# Altium project PCB_Project.PrjPcb
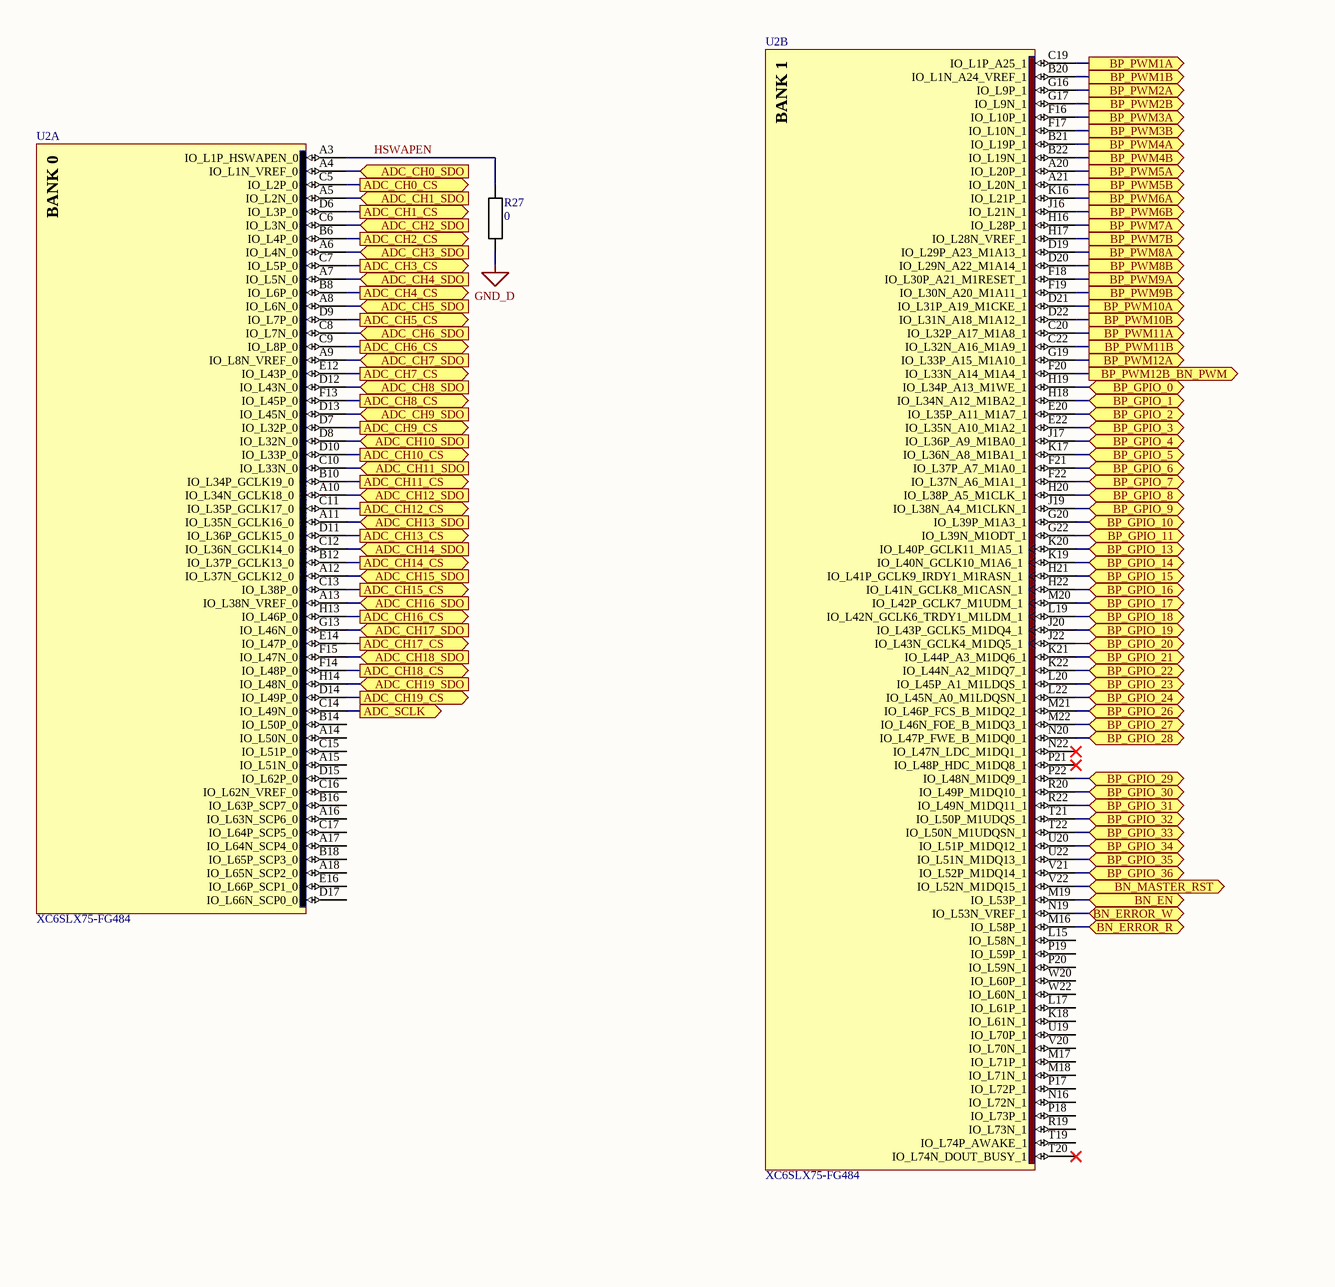
[diagram p0: FPGA_0.SchDoc, left]
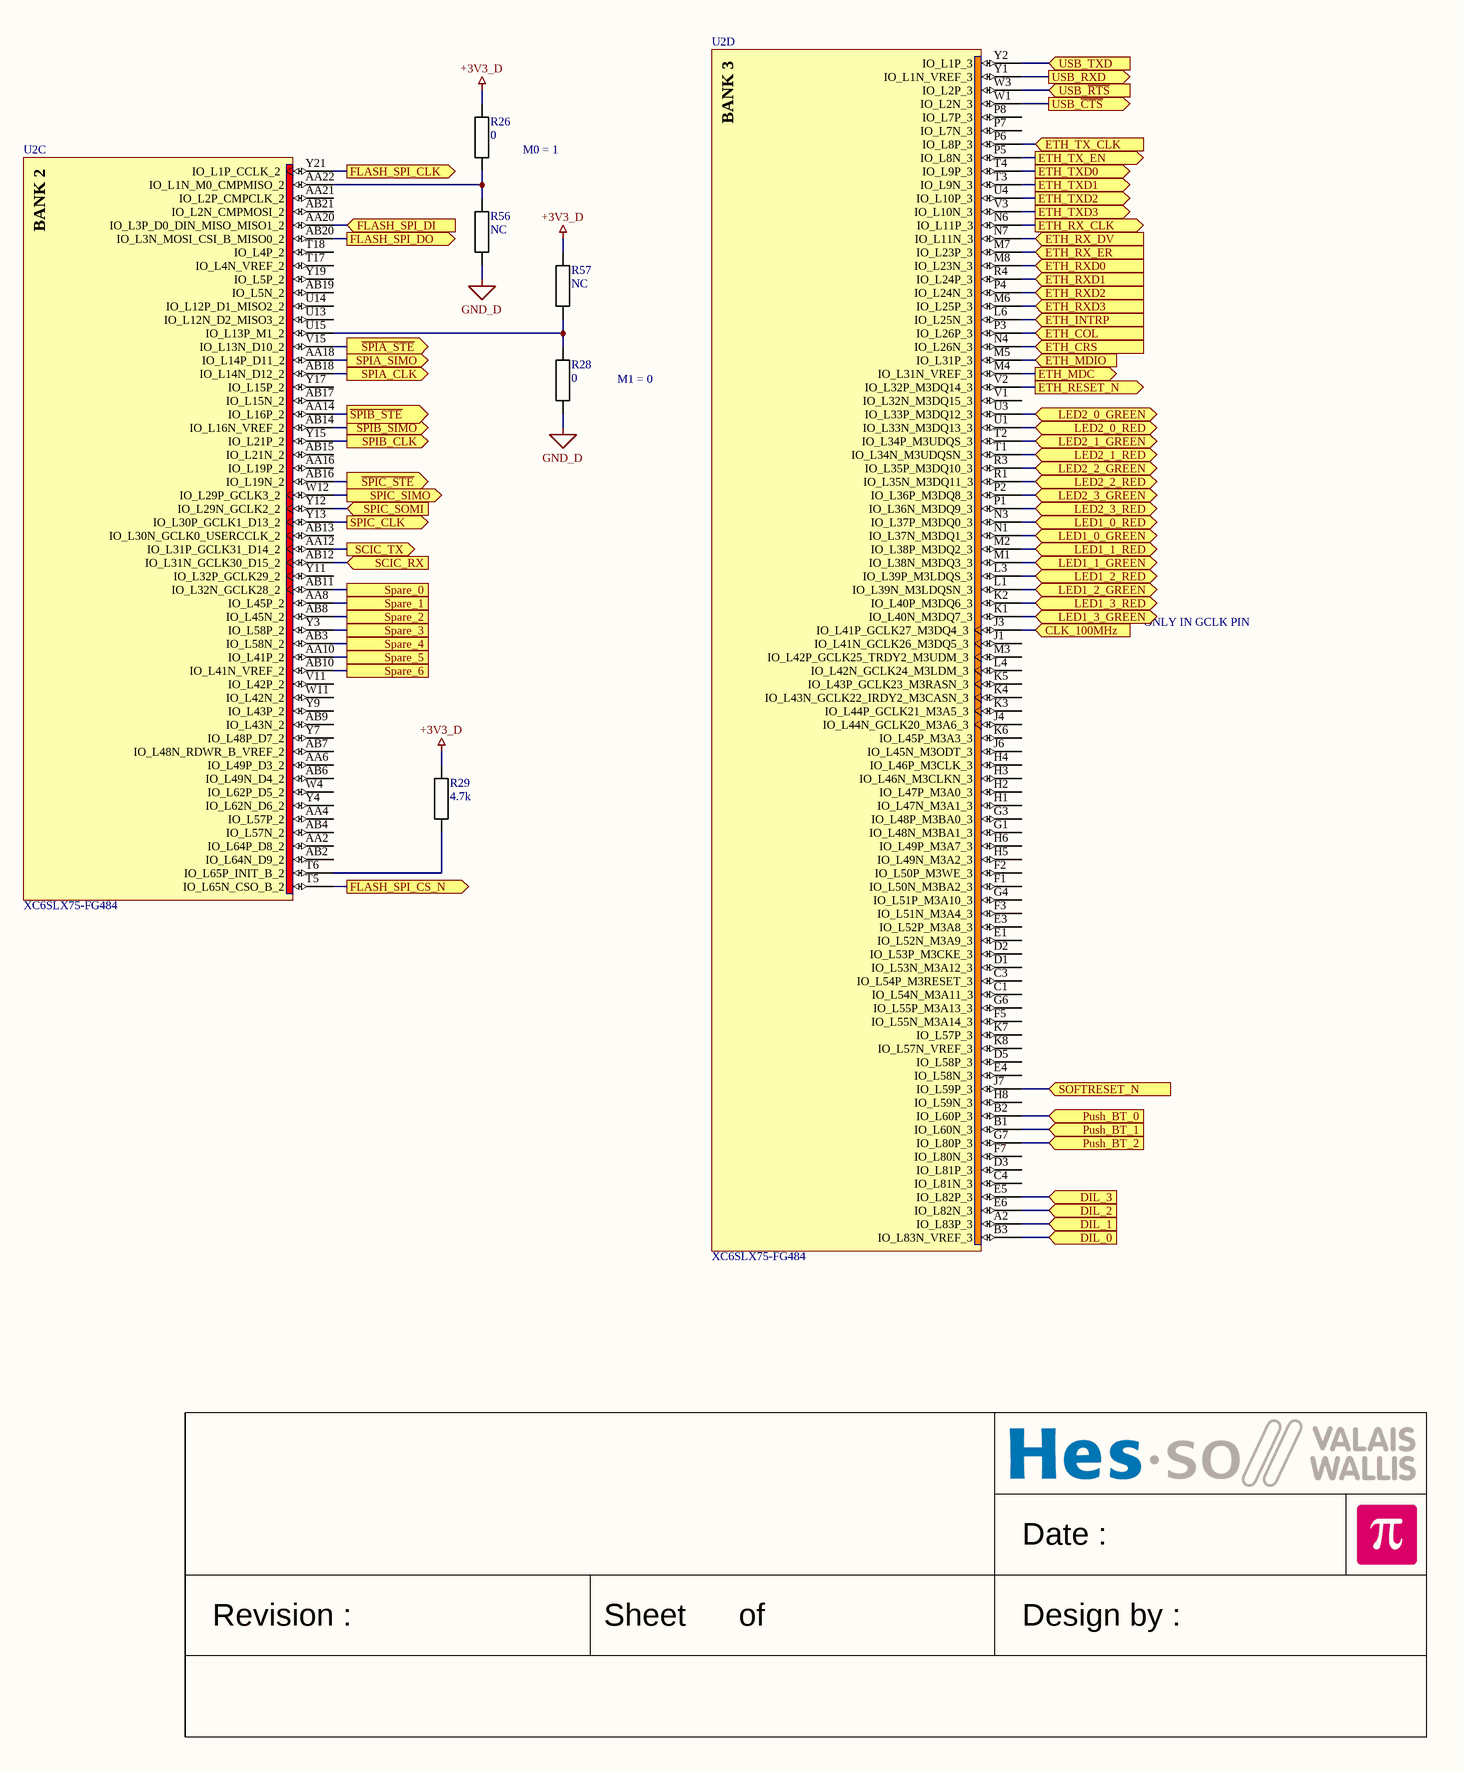
[diagram p1: FPGA_0.SchDoc, right]
3 sheets, 104 parts. Net scope: flat (ports and power ports of the same name join across sheets).
Board file: FPGA_Board.PcbDoc
Sheets:
  FPGA_0.SchDoc
  FPGA_1.SchDoc
  Ethernet_0.SchDoc

## Sheet FPGA_0.SchDoc
size A2; Date: Date; CompanyName: HESSO; Engineer: Name; Address1: Route du Rawyl 47; Address2: 1950 Sion; Address3: Switzerland; ProjectName: Project Name

### Parts
R26  0  [RESISTOR 2012 REFLOW]
R27  0  [RESISTOR 2012 REFLOW]
R28  0  [RESISTOR 2012 REFLOW]
R29  4.7k  [RESISTOR 2012 REFLOW]
R56  NC  [RESISTOR 2012 REFLOW]
R57  NC  [RESISTOR 2012 REFLOW]
U2  XC6SLX75-FG484  [BGA484 P1.0 C23X23 H2.2]  (parts A,B,C,D of 8)

### Ports
ADC_CH0_CS (out), ADC_CH0_SDO (in), ADC_CH1_CS (out), ADC_CH1_SDO (in), ADC_CH2_CS (out), ADC_CH2_SDO (in), ADC_CH3_CS (out), ADC_CH3_SDO (in), ADC_CH4_CS (out), ADC_CH4_SDO (in), ADC_CH5_CS (out), ADC_CH5_SDO (in), ADC_CH6_CS (out), ADC_CH6_SDO (in), ADC_CH7_CS (out), ADC_CH7_SDO (in), ADC_CH8_CS (out), ADC_CH8_SDO (in), ADC_CH9_CS (out), ADC_CH9_SDO (in), ADC_CH10_CS (out), ADC_CH10_SDO (in), ADC_CH11_CS (out), ADC_CH11_SDO (in), ADC_CH12_CS (out), ADC_CH12_SDO (in), ADC_CH13_CS (out), ADC_CH13_SDO (in), ADC_CH14_CS (out), ADC_CH14_SDO (in), ADC_CH15_CS (out), ADC_CH15_SDO (in), ADC_CH16_CS (out), ADC_CH16_SDO (in), ADC_CH17_CS (out), ADC_CH17_SDO (in), ADC_CH18_CS (out), ADC_CH18_SDO (in), ADC_CH19_CS (out), ADC_CH19_SDO (in), ADC_SCLK (out), BN_EN (bidir), BN_ERROR_R (bidir), BN_ERROR_W (bidir), BN_MASTER_RST (bidir), BP_GPIO_0 (bidir), BP_GPIO_1 (bidir), BP_GPIO_2 (bidir), BP_GPIO_3 (bidir), BP_GPIO_4 (bidir), BP_GPIO_5 (bidir), BP_GPIO_6 (bidir), BP_GPIO_7 (bidir), BP_GPIO_8 (bidir), BP_GPIO_9 (bidir), BP_GPIO_10 (bidir), BP_GPIO_11 (bidir), BP_GPIO_13 (bidir), BP_GPIO_14 (bidir), BP_GPIO_15 (bidir), BP_GPIO_16 (bidir), BP_GPIO_17 (bidir), BP_GPIO_18 (bidir), BP_GPIO_19 (bidir), BP_GPIO_20 (bidir), BP_GPIO_21 (bidir), BP_GPIO_22 (bidir), BP_GPIO_23 (bidir), BP_GPIO_24 (bidir), BP_GPIO_26 (bidir), BP_GPIO_27 (bidir), BP_GPIO_28 (bidir), BP_GPIO_29 (bidir), BP_GPIO_30 (bidir), BP_GPIO_31 (bidir), BP_GPIO_32 (bidir), BP_GPIO_33 (bidir), BP_GPIO_34 (bidir), BP_GPIO_35 (bidir), BP_GPIO_36 (bidir), BP_PWM1A (out), BP_PWM1B (out), BP_PWM2A (out), BP_PWM2B (out), BP_PWM3A (out), BP_PWM3B (out), BP_PWM4A (out), BP_PWM4B (out), BP_PWM5A (out), BP_PWM5B (out), BP_PWM6A (out), BP_PWM6B (out), BP_PWM7A (out), BP_PWM7B (out), BP_PWM8A (out), BP_PWM8B (out), BP_PWM9A (out), BP_PWM9B (out), BP_PWM10A (out), BP_PWM10B (out), BP_PWM11A (out), BP_PWM11B (out), BP_PWM12A (out), BP_PWM12B_BN_PWM (out), CLK_100MHz (in), DIL_0 (in), DIL_1 (in), DIL_2 (in), DIL_3 (in), ETH_COL (in), ETH_CRS (in), ETH_INTRP (in), ETH_MDC (out), ETH_MDIO (in), ETH_RESET_N (out), ETH_RX_CLK (out), ETH_RX_DV (in), ETH_RX_ER (in), ETH_RXD0 (in), ETH_RXD1 (in), ETH_RXD2 (in), ETH_RXD3 (in), ETH_TX_CLK (in), ETH_TX_EN (out), ETH_TXD0 (out), ETH_TXD1 (out), ETH_TXD2 (out), ETH_TXD3 (out), FLASH_SPI_CLK (out), FLASH_SPI_CS_N (out), FLASH_SPI_DI (in), FLASH_SPI_DO (out), LED1_0_GREEN (bidir), LED1_0_RED (bidir), LED1_1_GREEN (bidir), LED1_1_RED (bidir), LED1_2_GREEN (bidir), LED1_2_RED (bidir), LED1_3_GREEN (bidir), LED1_3_RED (bidir), LED2_0_GREEN (bidir), LED2_0_RED (bidir), LED2_1_GREEN (bidir), LED2_1_RED (bidir), LED2_2_GREEN (bidir), LED2_2_RED (bidir), LED2_3_GREEN (bidir), LED2_3_RED (bidir), Push_BT_0 (in), Push_BT_1 (in), Push_BT_2 (in), SCIC_RX (in), SCIC_TX (out), SOFTRESET_N (in), Spare_0, Spare_1, Spare_2, Spare_3, Spare_4, Spare_5, Spare_6, SPIA_CLK (out), SPIA_SIMO (out), SPIB_CLK (out), SPIB_SIMO (out), SPIC_CLK (out), SPIC_SIMO (out), SPIC_SOMI (in), USB_RXD (out), USB_TXD (in), USB_~{CTS} (out), USB_~{RTS} (in), ~{SPIA_STE} (out), ~{SPIB_STE} (out), ~{SPIC_STE} (out)

### Nets
+3V3_D: R26.2 R29.2 R57.2
GND_D: R27.1 R28.1 R56.1
~{SPIA_STE}: U2.V15(IO_L13N_D10_2) ; port ~{SPIA_STE}
~{SPIB_STE}: U2.AA14(IO_L16P_2) ; port ~{SPIB_STE}
~{SPIC_STE}: U2.AB16(IO_L19N_2) ; port ~{SPIC_STE}
ADC_CH0_CS: U2.C5(IO_L2P_0) ; port ADC_CH0_CS
ADC_CH0_SDO: U2.A4(IO_L1N_VREF_0) ; port ADC_CH0_SDO
ADC_CH1_CS: U2.D6(IO_L3P_0) ; port ADC_CH1_CS
ADC_CH1_SDO: U2.A5(IO_L2N_0) ; port ADC_CH1_SDO
ADC_CH2_CS: U2.B6(IO_L4P_0) ; port ADC_CH2_CS
ADC_CH2_SDO: U2.C6(IO_L3N_0) ; port ADC_CH2_SDO
ADC_CH3_CS: U2.C7(IO_L5P_0) ; port ADC_CH3_CS
ADC_CH3_SDO: U2.A6(IO_L4N_0) ; port ADC_CH3_SDO
ADC_CH4_CS: U2.B8(IO_L6P_0) ; port ADC_CH4_CS
ADC_CH4_SDO: U2.A7(IO_L5N_0) ; port ADC_CH4_SDO
ADC_CH5_CS: U2.D9(IO_L7P_0) ; port ADC_CH5_CS
ADC_CH5_SDO: U2.A8(IO_L6N_0) ; port ADC_CH5_SDO
ADC_CH6_CS: U2.C9(IO_L8P_0) ; port ADC_CH6_CS
ADC_CH6_SDO: U2.C8(IO_L7N_0) ; port ADC_CH6_SDO
ADC_CH7_CS: U2.E12(IO_L43P_0) ; port ADC_CH7_CS
ADC_CH7_SDO: U2.A9(IO_L8N_VREF_0) ; port ADC_CH7_SDO
ADC_CH8_CS: U2.F13(IO_L45P_0) ; port ADC_CH8_CS
ADC_CH8_SDO: U2.D12(IO_L43N_0) ; port ADC_CH8_SDO
ADC_CH9_CS: U2.D7(IO_L32P_0) ; port ADC_CH9_CS
ADC_CH9_SDO: U2.D13(IO_L45N_0) ; port ADC_CH9_SDO
ADC_CH10_CS: U2.D10(IO_L33P_0) ; port ADC_CH10_CS
ADC_CH10_SDO: U2.D8(IO_L32N_0) ; port ADC_CH10_SDO
ADC_CH11_CS: U2.B10(IO_L34P_GCLK19_0) ; port ADC_CH11_CS
ADC_CH11_SDO: U2.C10(IO_L33N_0) ; port ADC_CH11_SDO
ADC_CH12_CS: U2.C11(IO_L35P_GCLK17_0) ; port ADC_CH12_CS
ADC_CH12_SDO: U2.A10(IO_L34N_GCLK18_0) ; port ADC_CH12_SDO
ADC_CH13_CS: U2.D11(IO_L36P_GCLK15_0) ; port ADC_CH13_CS
ADC_CH13_SDO: U2.A11(IO_L35N_GCLK16_0) ; port ADC_CH13_SDO
ADC_CH14_CS: U2.B12(IO_L37P_GCLK13_0) ; port ADC_CH14_CS
ADC_CH14_SDO: U2.C12(IO_L36N_GCLK14_0) ; port ADC_CH14_SDO
ADC_CH15_CS: U2.C13(IO_L38P_0) ; port ADC_CH15_CS
ADC_CH15_SDO: U2.A12(IO_L37N_GCLK12_0) ; port ADC_CH15_SDO
ADC_CH16_CS: U2.H13(IO_L46P_0) ; port ADC_CH16_CS
ADC_CH16_SDO: U2.A13(IO_L38N_VREF_0) ; port ADC_CH16_SDO
ADC_CH17_CS: U2.E14(IO_L47P_0) ; port ADC_CH17_CS
ADC_CH17_SDO: U2.G13(IO_L46N_0) ; port ADC_CH17_SDO
ADC_CH18_CS: U2.F14(IO_L48P_0) ; port ADC_CH18_CS
ADC_CH18_SDO: U2.F15(IO_L47N_0) ; port ADC_CH18_SDO
ADC_CH19_CS: U2.D14(IO_L49P_0) ; port ADC_CH19_CS
ADC_CH19_SDO: U2.H14(IO_L48N_0) ; port ADC_CH19_SDO
ADC_SCLK: U2.C14(IO_L49N_0) ; port ADC_SCLK
BN_EN: U2.M19(IO_L53P_1) ; port BN_EN
BN_ERROR_R: U2.M16(IO_L58P_1) ; port BN_ERROR_R
BN_ERROR_W: U2.N19(IO_L53N_VREF_1) ; port BN_ERROR_W
BN_MASTER_RST: U2.V22(IO_L52N_M1DQ15_1) ; port BN_MASTER_RST
BP_GPIO_0: U2.H19(IO_L34P_A13_M1WE_1) ; port BP_GPIO_0
BP_GPIO_1: U2.H18(IO_L34N_A12_M1BA2_1) ; port BP_GPIO_1
BP_GPIO_2: U2.E20(IO_L35P_A11_M1A7_1) ; port BP_GPIO_2
BP_GPIO_3: U2.E22(IO_L35N_A10_M1A2_1) ; port BP_GPIO_3
BP_GPIO_4: U2.J17(IO_L36P_A9_M1BA0_1) ; port BP_GPIO_4
BP_GPIO_5: U2.K17(IO_L36N_A8_M1BA1_1) ; port BP_GPIO_5
BP_GPIO_6: U2.F21(IO_L37P_A7_M1A0_1) ; port BP_GPIO_6
BP_GPIO_7: U2.F22(IO_L37N_A6_M1A1_1) ; port BP_GPIO_7
BP_GPIO_8: U2.H20(IO_L38P_A5_M1CLK_1) ; port BP_GPIO_8
BP_GPIO_9: U2.J19(IO_L38N_A4_M1CLKN_1) ; port BP_GPIO_9
BP_GPIO_10: U2.G20(IO_L39P_M1A3_1) ; port BP_GPIO_10
BP_GPIO_11: U2.G22(IO_L39N_M1ODT_1) ; port BP_GPIO_11
BP_GPIO_13: U2.K20(IO_L40P_GCLK11_M1A5_1) ; port BP_GPIO_13
BP_GPIO_14: U2.K19(IO_L40N_GCLK10_M1A6_1) ; port BP_GPIO_14
BP_GPIO_15: U2.H21(IO_L41P_GCLK9_IRDY1_M1RASN_1) ; port BP_GPIO_15
BP_GPIO_16: U2.H22(IO_L41N_GCLK8_M1CASN_1) ; port BP_GPIO_16
BP_GPIO_17: U2.M20(IO_L42P_GCLK7_M1UDM_1) ; port BP_GPIO_17
BP_GPIO_18: U2.L19(IO_L42N_GCLK6_TRDY1_M1LDM_1) ; port BP_GPIO_18
BP_GPIO_19: U2.J20(IO_L43P_GCLK5_M1DQ4_1) ; port BP_GPIO_19
BP_GPIO_20: U2.J22(IO_L43N_GCLK4_M1DQ5_1) ; port BP_GPIO_20
BP_GPIO_21: U2.K21(IO_L44P_A3_M1DQ6_1) ; port BP_GPIO_21
BP_GPIO_22: U2.K22(IO_L44N_A2_M1DQ7_1) ; port BP_GPIO_22
BP_GPIO_23: U2.L20(IO_L45P_A1_M1LDQS_1) ; port BP_GPIO_23
BP_GPIO_24: U2.L22(IO_L45N_A0_M1LDQSN_1) ; port BP_GPIO_24
BP_GPIO_26: U2.M21(IO_L46P_FCS_B_M1DQ2_1) ; port BP_GPIO_26
BP_GPIO_27: U2.M22(IO_L46N_FOE_B_M1DQ3_1) ; port BP_GPIO_27
BP_GPIO_28: U2.N20(IO_L47P_FWE_B_M1DQ0_1) ; port BP_GPIO_28
BP_GPIO_29: U2.P22(IO_L48N_M1DQ9_1) ; port BP_GPIO_29
BP_GPIO_30: U2.R20(IO_L49P_M1DQ10_1) ; port BP_GPIO_30
BP_GPIO_31: U2.R22(IO_L49N_M1DQ11_1) ; port BP_GPIO_31
BP_GPIO_32: U2.T21(IO_L50P_M1UDQS_1) ; port BP_GPIO_32
BP_GPIO_33: U2.T22(IO_L50N_M1UDQSN_1) ; port BP_GPIO_33
BP_GPIO_34: U2.U20(IO_L51P_M1DQ12_1) ; port BP_GPIO_34
BP_GPIO_35: U2.U22(IO_L51N_M1DQ13_1) ; port BP_GPIO_35
BP_GPIO_36: U2.V21(IO_L52P_M1DQ14_1) ; port BP_GPIO_36
BP_PWM1A: U2.C19(IO_L1P_A25_1) ; port BP_PWM1A
BP_PWM1B: U2.B20(IO_L1N_A24_VREF_1) ; port BP_PWM1B
BP_PWM2A: U2.G16(IO_L9P_1) ; port BP_PWM2A
BP_PWM2B: U2.G17(IO_L9N_1) ; port BP_PWM2B
BP_PWM3A: U2.F16(IO_L10P_1) ; port BP_PWM3A
BP_PWM3B: U2.F17(IO_L10N_1) ; port BP_PWM3B
BP_PWM4A: U2.B21(IO_L19P_1) ; port BP_PWM4A
BP_PWM4B: U2.B22(IO_L19N_1) ; port BP_PWM4B
BP_PWM5A: U2.A20(IO_L20P_1) ; port BP_PWM5A
BP_PWM5B: U2.A21(IO_L20N_1) ; port BP_PWM5B
BP_PWM6A: U2.K16(IO_L21P_1) ; port BP_PWM6A
BP_PWM6B: U2.J16(IO_L21N_1) ; port BP_PWM6B
BP_PWM7A: U2.H16(IO_L28P_1) ; port BP_PWM7A
BP_PWM7B: U2.H17(IO_L28N_VREF_1) ; port BP_PWM7B
BP_PWM8A: U2.D19(IO_L29P_A23_M1A13_1) ; port BP_PWM8A
BP_PWM8B: U2.D20(IO_L29N_A22_M1A14_1) ; port BP_PWM8B
BP_PWM9A: U2.F18(IO_L30P_A21_M1RESET_1) ; port BP_PWM9A
BP_PWM9B: U2.F19(IO_L30N_A20_M1A11_1) ; port BP_PWM9B
BP_PWM10A: U2.D21(IO_L31P_A19_M1CKE_1) ; port BP_PWM10A
BP_PWM10B: U2.D22(IO_L31N_A18_M1A12_1) ; port BP_PWM10B
BP_PWM11A: U2.C20(IO_L32P_A17_M1A8_1) ; port BP_PWM11A
BP_PWM11B: U2.C22(IO_L32N_A16_M1A9_1) ; port BP_PWM11B
BP_PWM12A: U2.G19(IO_L33P_A15_M1A10_1) ; port BP_PWM12A
BP_PWM12B_BN_PWM: U2.F20(IO_L33N_A14_M1A4_1) ; port BP_PWM12B_BN_PWM
CLK_100MHz: U2.J3(IO_L41P_GCLK27_M3DQ4_3) ; port CLK_100MHz
DIL_0: U2.B3(IO_L83N_VREF_3) ; port DIL_0
DIL_1: U2.A2(IO_L83P_3) ; port DIL_1
DIL_2: U2.E6(IO_L82N_3) ; port DIL_2
DIL_3: U2.E5(IO_L82P_3) ; port DIL_3
ETH_COL: U2.P3(IO_L26P_3) ; port ETH_COL
ETH_CRS: U2.N4(IO_L26N_3) ; port ETH_CRS
ETH_INTRP: U2.L6(IO_L25N_3) ; port ETH_INTRP
ETH_MDC: U2.M4(IO_L31N_VREF_3) ; port ETH_MDC
ETH_MDIO: U2.M5(IO_L31P_3) ; port ETH_MDIO
ETH_RESET_N: U2.V2(IO_L32P_M3DQ14_3) ; port ETH_RESET_N
ETH_RX_CLK: U2.N6(IO_L11P_3) ; port ETH_RX_CLK
ETH_RX_DV: U2.N7(IO_L11N_3) ; port ETH_RX_DV
ETH_RX_ER: U2.M7(IO_L23P_3) ; port ETH_RX_ER
ETH_RXD0: U2.M8(IO_L23N_3) ; port ETH_RXD0
ETH_RXD1: U2.R4(IO_L24P_3) ; port ETH_RXD1
ETH_RXD2: U2.P4(IO_L24N_3) ; port ETH_RXD2
ETH_RXD3: U2.M6(IO_L25P_3) ; port ETH_RXD3
ETH_TX_CLK: U2.P6(IO_L8P_3) ; port ETH_TX_CLK
ETH_TX_EN: U2.P5(IO_L8N_3) ; port ETH_TX_EN
ETH_TXD0: U2.T4(IO_L9P_3) ; port ETH_TXD0
ETH_TXD1: U2.T3(IO_L9N_3) ; port ETH_TXD1
ETH_TXD2: U2.U4(IO_L10P_3) ; port ETH_TXD2
ETH_TXD3: U2.V3(IO_L10N_3) ; port ETH_TXD3
FLASH_SPI_CLK: U2.Y21(IO_L1P_CCLK_2) ; port FLASH_SPI_CLK
FLASH_SPI_CS_N: U2.T5(IO_L65N_CSO_B_2) ; port FLASH_SPI_CS_N
FLASH_SPI_DI: U2.AA20(IO_L3P_D0_DIN_MISO_MISO1_2) ; port FLASH_SPI_DI
FLASH_SPI_DO: U2.AB20(IO_L3N_MOSI_CSI_B_MISO0_2) ; port FLASH_SPI_DO
HSWAPEN: R27.2 U2.A3(IO_L1P_HSWAPEN_0)
LED1_0_GREEN: U2.N1(IO_L37N_M3DQ1_3) ; port LED1_0_GREEN
LED1_0_RED: U2.N3(IO_L37P_M3DQ0_3) ; port LED1_0_RED
LED1_1_GREEN: U2.M1(IO_L38N_M3DQ3_3) ; port LED1_1_GREEN
LED1_1_RED: U2.M2(IO_L38P_M3DQ2_3) ; port LED1_1_RED
LED1_2_GREEN: U2.L1(IO_L39N_M3LDQSN_3) ; port LED1_2_GREEN
LED1_2_RED: U2.L3(IO_L39P_M3LDQS_3) ; port LED1_2_RED
LED1_3_GREEN: U2.K1(IO_L40N_M3DQ7_3) ; port LED1_3_GREEN
LED1_3_RED: U2.K2(IO_L40P_M3DQ6_3) ; port LED1_3_RED
LED2_0_GREEN: U2.U3(IO_L33P_M3DQ12_3) ; port LED2_0_GREEN
LED2_0_RED: U2.U1(IO_L33N_M3DQ13_3) ; port LED2_0_RED
LED2_1_GREEN: U2.T2(IO_L34P_M3UDQS_3) ; port LED2_1_GREEN
LED2_1_RED: U2.T1(IO_L34N_M3UDQSN_3) ; port LED2_1_RED
LED2_2_GREEN: U2.R3(IO_L35P_M3DQ10_3) ; port LED2_2_GREEN
LED2_2_RED: U2.R1(IO_L35N_M3DQ11_3) ; port LED2_2_RED
LED2_3_GREEN: U2.P2(IO_L36P_M3DQ8_3) ; port LED2_3_GREEN
LED2_3_RED: U2.P1(IO_L36N_M3DQ9_3) ; port LED2_3_RED
Push_BT_0: U2.B2(IO_L60P_3) ; port Push_BT_0
Push_BT_1: U2.B1(IO_L60N_3) ; port Push_BT_1
Push_BT_2: U2.G7(IO_L80P_3) ; port Push_BT_2
SCIC_RX: U2.AB12(IO_L31N_GCLK30_D15_2) ; port SCIC_RX
SCIC_TX: U2.AA12(IO_L31P_GCLK31_D14_2) ; port SCIC_TX
SOFTRESET_N: U2.J7(IO_L59P_3) ; port SOFTRESET_N
Spare_0: U2.AB11(IO_L32N_GCLK28_2) ; port Spare_0
Spare_1: U2.AA8(IO_L45P_2) ; port Spare_1
Spare_2: U2.AB8(IO_L45N_2) ; port Spare_2
Spare_3: U2.Y3(IO_L58P_2) ; port Spare_3
Spare_4: U2.AB3(IO_L58N_2) ; port Spare_4
Spare_5: U2.AA10(IO_L41P_2) ; port Spare_5
Spare_6: U2.AB10(IO_L41N_VREF_2) ; port Spare_6
SPIA_CLK: U2.AB18(IO_L14N_D12_2) ; port SPIA_CLK
SPIA_SIMO: U2.AA18(IO_L14P_D11_2) ; port SPIA_SIMO
SPIB_CLK: U2.Y15(IO_L21P_2) ; port SPIB_CLK
SPIB_SIMO: U2.AB14(IO_L16N_VREF_2) ; port SPIB_SIMO
SPIC_CLK: U2.Y13(IO_L30P_GCLK1_D13_2) ; port SPIC_CLK
SPIC_SIMO: U2.W12(IO_L29P_GCLK3_2) ; port SPIC_SIMO
SPIC_SOMI: U2.Y12(IO_L29N_GCLK2_2) ; port SPIC_SOMI
USB_~{CTS}: U2.W1(IO_L2N_3) ; port USB_~{CTS}
USB_~{RTS}: U2.W3(IO_L2P_3) ; port USB_~{RTS}
USB_RXD: U2.Y1(IO_L1N_VREF_3) ; port USB_RXD
USB_TXD: U2.Y2(IO_L1P_3) ; port USB_TXD
NetR26_1: R26.1 R56.2 U2.AA22(IO_L1N_M0_CMPMISO_2)
NetR28_2: R28.2 R57.1 U2.U15(IO_L13P_M1_2)
NetR29_1: R29.1 U2.T6(IO_L65P_INIT_B_2)

Not connected (* = marked no-connect by the designer): U2 A14(IO_L50N_0) A15(IO_L51N_0) A16(IO_L63N_SCP6_0) A17(IO_L64N_SCP4_0) A18(IO_L65N_SCP2_0) AA2(IO_L64P_D8_2) AA4(IO_L57P_2) AA6(IO_L49P_D3_2) AA16(IO_L19P_2) AA21(IO_L2P_CMPCLK_2) AB2(IO_L64N_D9_2) AB4(IO_L57N_2) AB6(IO_L49N_D4_2) AB7(IO_L48N_RDWR_B_VREF_2) AB9(IO_L43N_2) AB13(IO_L30N_GCLK0_USERCCLK_2) AB15(IO_L21N_2) AB17(IO_L15N_2) AB19(IO_L5N_2) AB21(IO_L2N_CMPMOSI_2) B14(IO_L50P_0) B16(IO_L63P_SCP7_0) B18(IO_L65P_SCP3_0) C1(IO_L54N_M3A11_3) C3(IO_L54P_M3RESET_3) C4(IO_L81N_3) C15(IO_L51P_0) C16(IO_L62N_VREF_0) C17(IO_L64P_SCP5_0) D1(IO_L53N_M3A12_3) D2(IO_L53P_M3CKE_3) D3(IO_L81P_3) D5(IO_L58P_3) D15(IO_L62P_0) D17(IO_L66N_SCP0_0) E1(IO_L52N_M3A9_3) E3(IO_L52P_M3A8_3) E4(IO_L58N_3) E16(IO_L66P_SCP1_0) F1(IO_L50N_M3BA2_3) F2(IO_L50P_M3WE_3) F3(IO_L51N_M3A4_3) F5(IO_L55N_M3A14_3) F7(IO_L80N_3) G1(IO_L48N_M3BA1_3) G3(IO_L48P_M3BA0_3) G4(IO_L51P_M3A10_3) G6(IO_L55P_M3A13_3) H1(IO_L47N_M3A1_3) H2(IO_L47P_M3A0_3) H3(IO_L46N_M3CLKN_3) H4(IO_L46P_M3CLK_3) H5(IO_L49N_M3A2_3) H6(IO_L49P_M3A7_3) H8(IO_L59N_3) J1(IO_L41N_GCLK26_M3DQ5_3) J4(IO_L44N_GCLK20_M3A6_3) J6(IO_L45N_M3ODT_3) K3(IO_L44P_GCLK21_M3A5_3) K4(IO_L43N_GCLK22_IRDY2_M3CASN_3) K5(IO_L43P_GCLK23_M3RASN_3) K6(IO_L45P_M3A3_3) K7(IO_L57P_3) K8(IO_L57N_VREF_3) K18(IO_L61N_1) L4(IO_L42N_GCLK24_M3LDM_3) L15(IO_L58N_1) L17(IO_L61P_1) M3(IO_L42P_GCLK25_TRDY2_M3UDM_3) M17(IO_L71P_1) M18(IO_L71N_1) N16(IO_L72N_1) N22(IO_L47N_LDC_M1DQ1_1)* P7(IO_L7N_3) P8(IO_L7P_3) P17(IO_L72P_1) P18(IO_L73P_1) P19(IO_L59P_1) P20(IO_L59N_1) P21(IO_L48P_HDC_M1DQ8_1)* R19(IO_L73N_1) T17(IO_L4N_VREF_2) T18(IO_L4P_2) T19(IO_L74P_AWAKE_1) T20(IO_L74N_DOUT_BUSY_1)* U13(IO_L12N_D2_MISO3_2) U14(IO_L12P_D1_MISO2_2) U19(IO_L70P_1) V1(IO_L32N_M3DQ15_3) V11(IO_L42P_2) V20(IO_L70N_1) W4(IO_L62P_D5_2) W11(IO_L42N_2) W20(IO_L60P_1) W22(IO_L60N_1) Y4(IO_L62N_D6_2) Y7(IO_L48P_D7_2) Y9(IO_L43P_2) Y11(IO_L32P_GCLK29_2) Y17(IO_L15P_2) Y19(IO_L5P_2)

### Notes on the sheet
- (near R26) M0 = 1
- M1 = 0
- ONLY IN GCLK PIN
- Date :
- Revision :
- Sheet
- of
- Design by :
- (in symbol XC6SLX75-FG484, part A) BANK 0
- (in symbol XC6SLX75-FG484, part B) BANK 1
- (in symbol XC6SLX75-FG484, part C) BANK 2
- (in symbol XC6SLX75-FG484, part D) BANK 3

### Library data of the parts
R26-R29 R56 R57 = Resistor: Resistor 1% 50V 125mW 2012(0805)
  R26-R28: Value: 0
  R29: Value: 4.7k
  R56 R57: Value: NC
U2 = XC6SLX75-FG484: Spartan-6 LXT 1.2V FPGA, 268 User I/Os, 484-Ball Fine-Pitch BGA (1.0mm Pitch); Value: XC6SLX75-FG484

## Sheet FPGA_1.SchDoc
size A2; Date: Date; CompanyName: HESSO; Engineer: Name; Address1: Route du Rawyl 47; Address2: 1950 Sion; Address3: Switzerland; ProjectName: Project Name
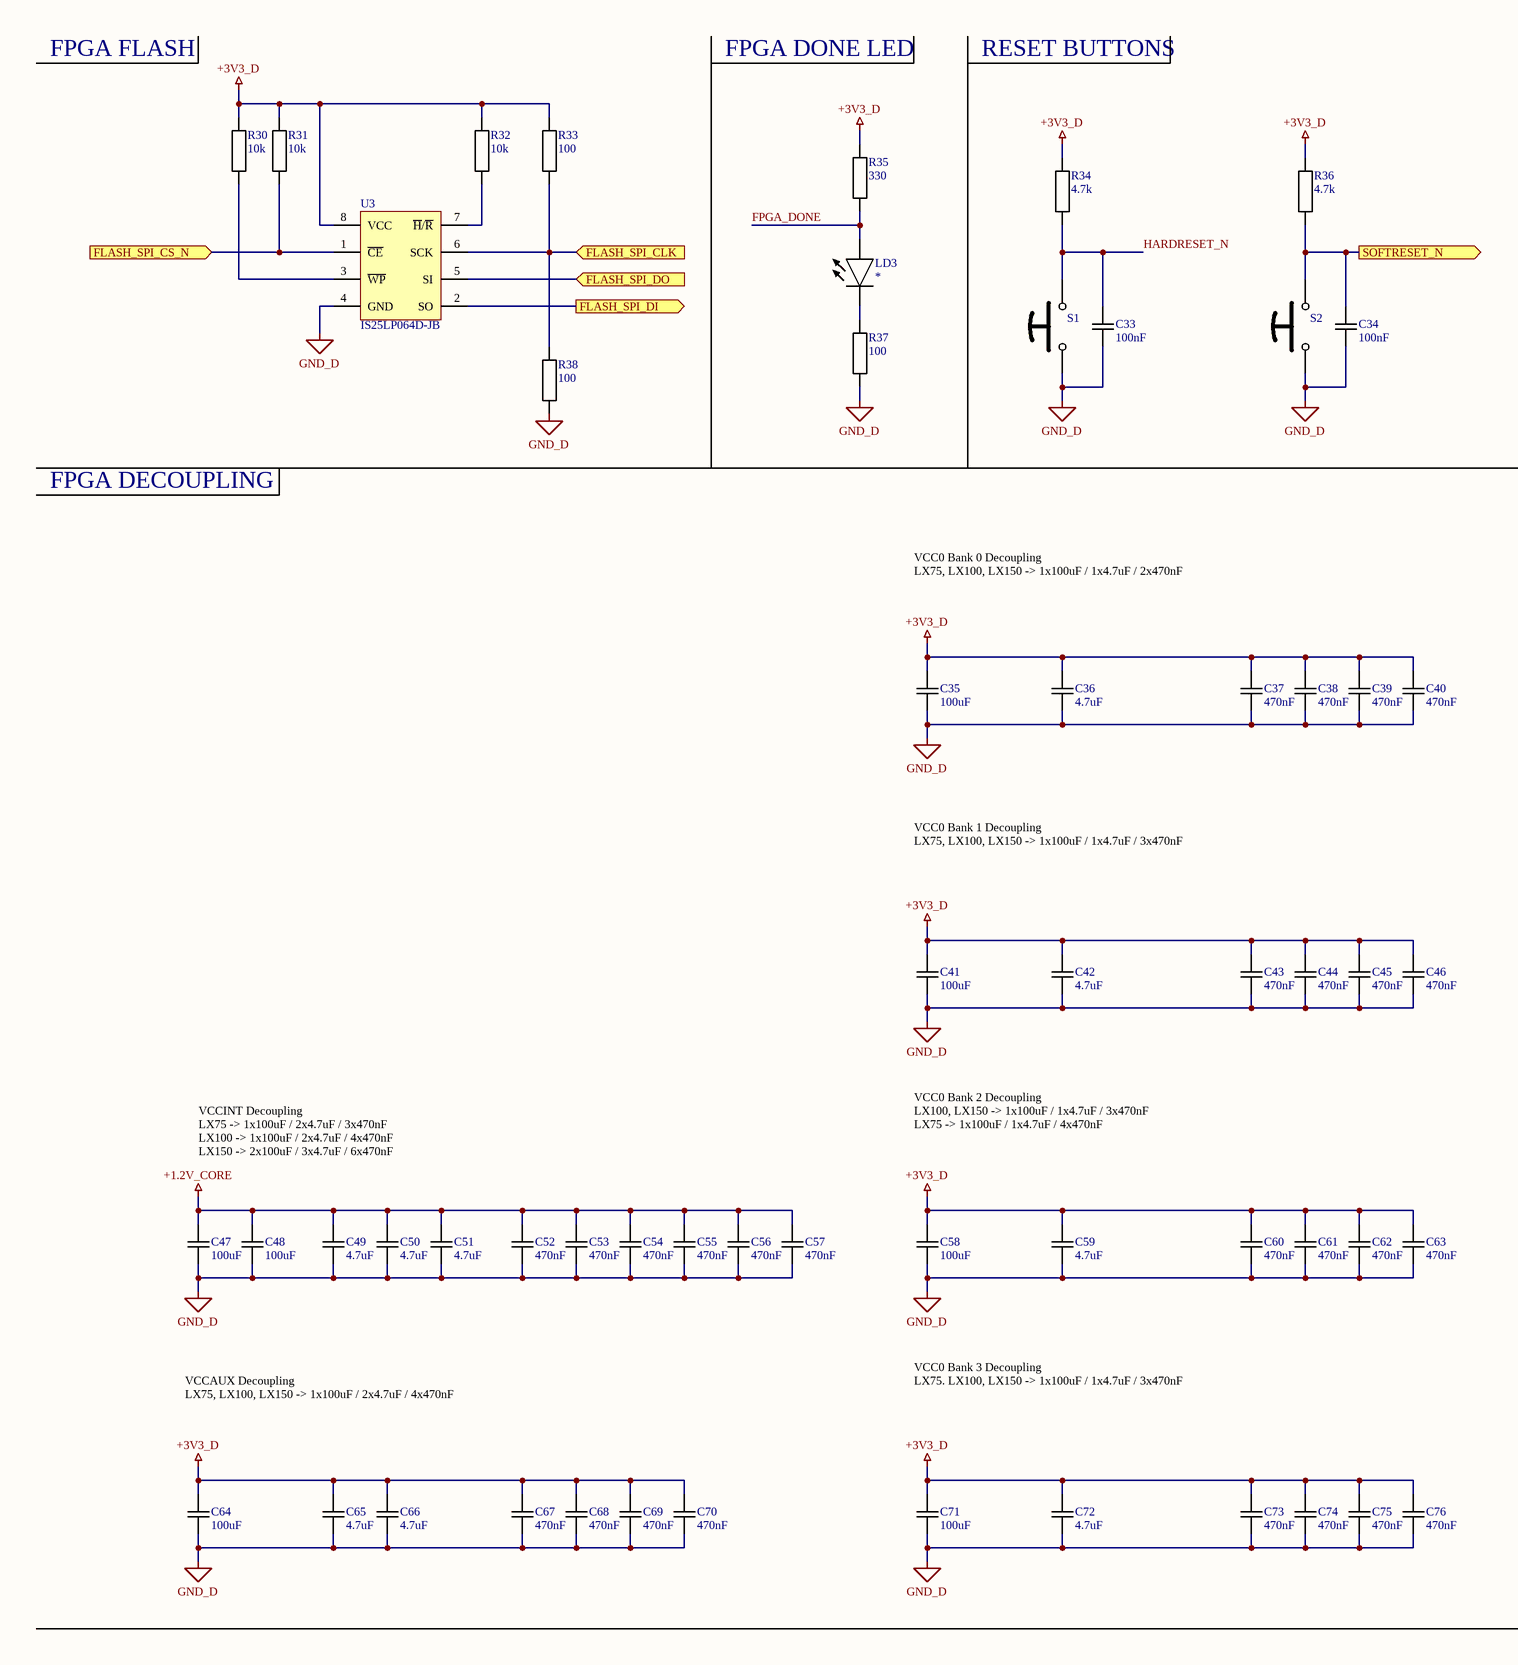
[diagram p2: FPGA_1.SchDoc, left]
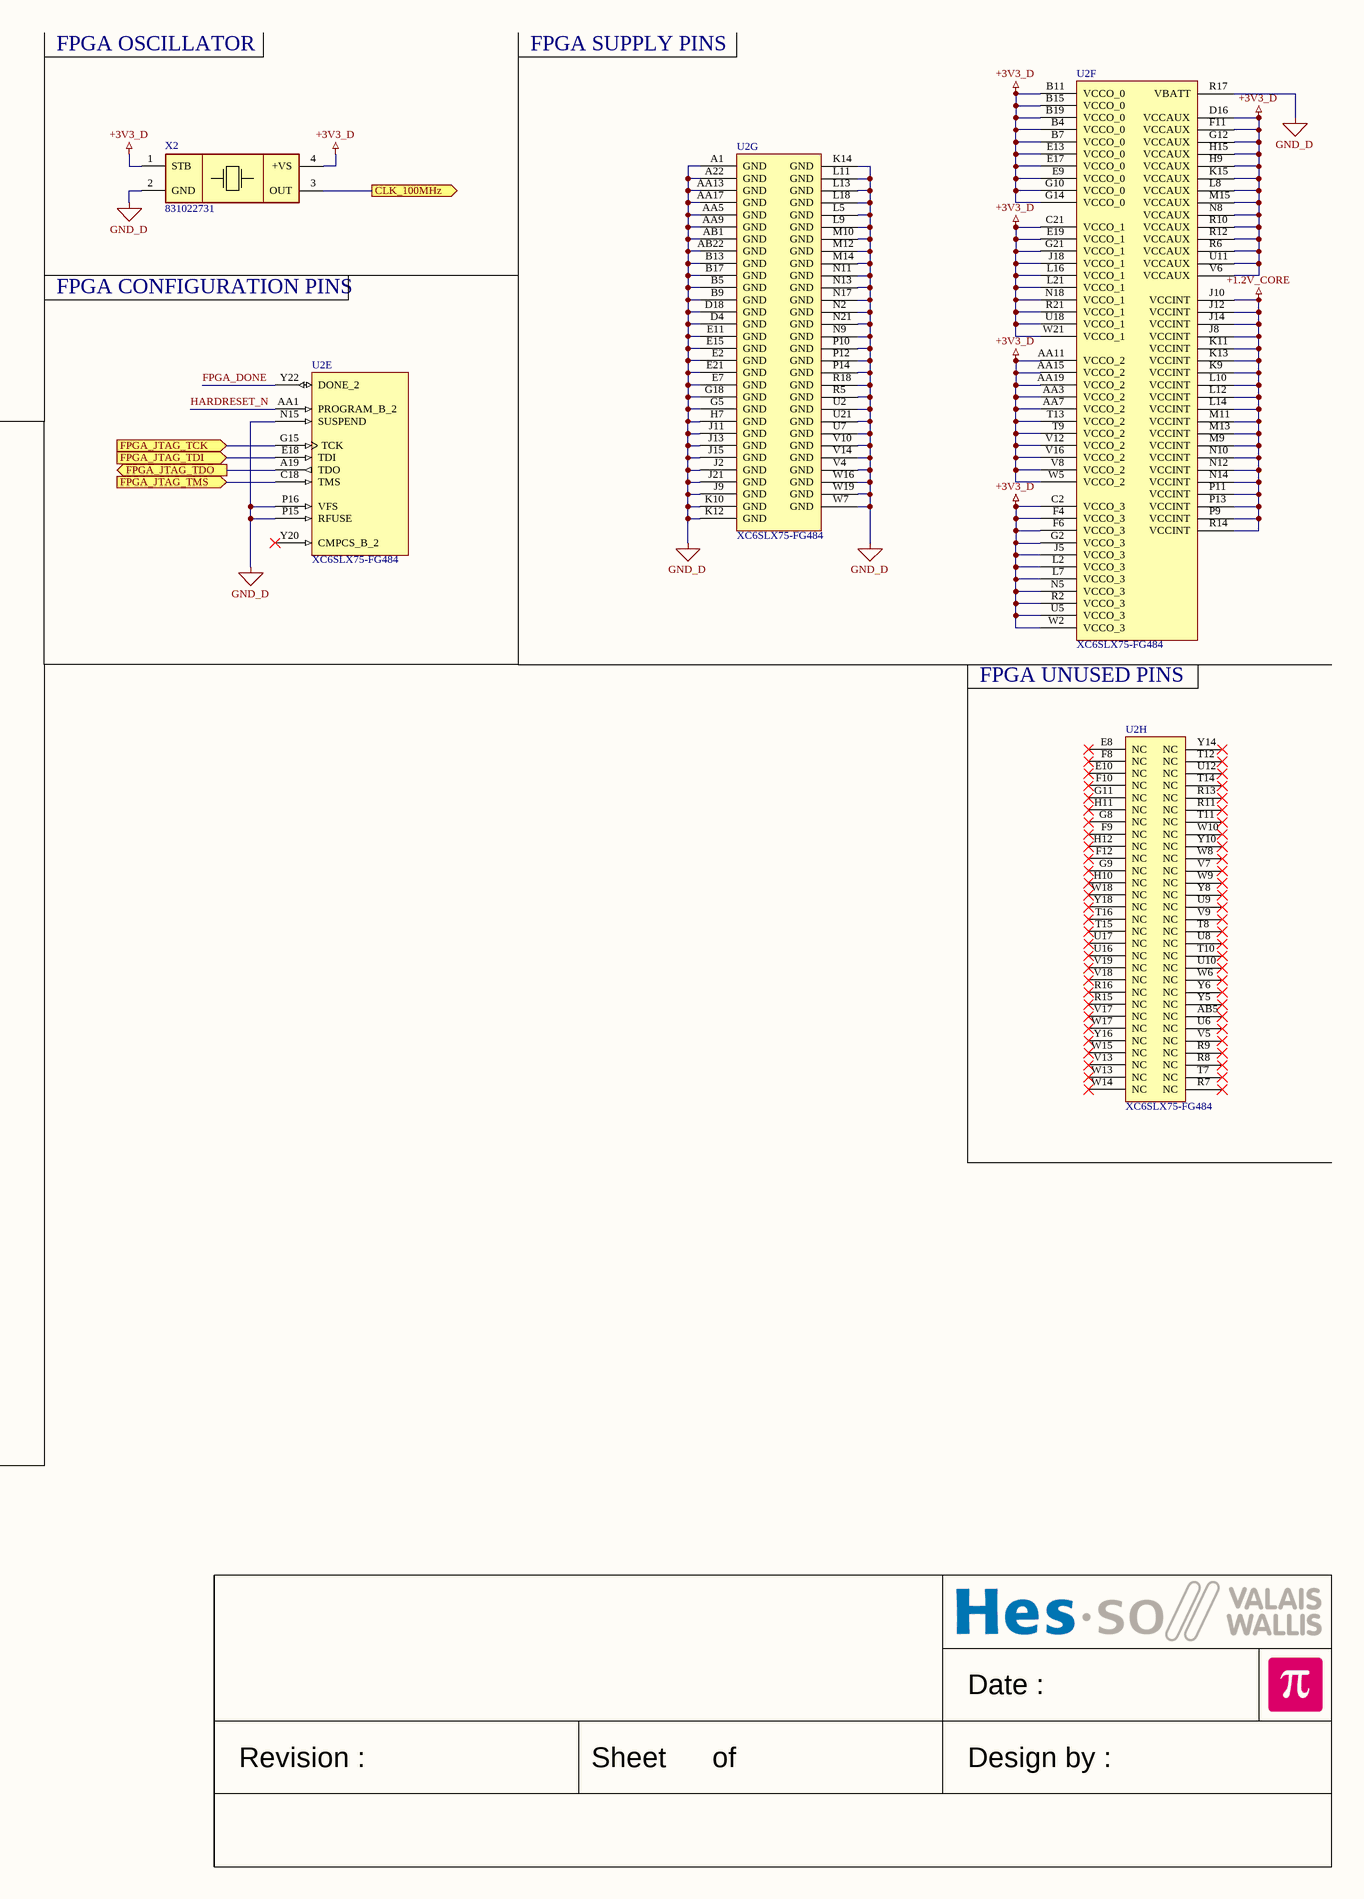
[diagram p3: FPGA_1.SchDoc, right]

### Parts
C33  100nF  [CAPACITOR 1608 REFLOW]
C34  100nF  [CAPACITOR 1608 REFLOW]
C35  100uF  [CAPACITOR 3216 REFLOW]
C36  4.7uF  [CAPACITOR 1608 REFLOW]
C37  470nF  [CAPACITOR 1005 REFLOW]
C38  470nF  [CAPACITOR 1005 REFLOW]
C39  470nF  [CAPACITOR 1005 REFLOW]
C40  470nF  [CAPACITOR 1005 REFLOW]
C41  100uF  [CAPACITOR 3216 REFLOW]
C42  4.7uF  [CAPACITOR 1608 REFLOW]
C43  470nF  [CAPACITOR 1005 REFLOW]
C44  470nF  [CAPACITOR 1005 REFLOW]
C45  470nF  [CAPACITOR 1005 REFLOW]
C46  470nF  [CAPACITOR 1005 REFLOW]
C47  100uF  [CAPACITOR 3216 REFLOW]
C48  100uF  [CAPACITOR 3216 REFLOW]
C49  4.7uF  [CAPACITOR 1608 REFLOW]
C50  4.7uF  [CAPACITOR 1608 REFLOW]
C51  4.7uF  [CAPACITOR 1608 REFLOW]
C52  470nF  [CAPACITOR 1005 REFLOW]
C53  470nF  [CAPACITOR 1005 REFLOW]
C54  470nF  [CAPACITOR 1005 REFLOW]
C55  470nF  [CAPACITOR 1005 REFLOW]
C56  470nF  [CAPACITOR 1005 REFLOW]
C57  470nF  [CAPACITOR 1005 REFLOW]
C58  100uF  [CAPACITOR 3216 REFLOW]
C59  4.7uF  [CAPACITOR 1608 REFLOW]
C60  470nF  [CAPACITOR 1005 REFLOW]
C61  470nF  [CAPACITOR 1005 REFLOW]
C62  470nF  [CAPACITOR 1005 REFLOW]
C63  470nF  [CAPACITOR 1005 REFLOW]
C64  100uF  [CAPACITOR 3216 REFLOW]
C65  4.7uF  [CAPACITOR 1608 REFLOW]
C66  4.7uF  [CAPACITOR 1608 REFLOW]
C67  470nF  [CAPACITOR 1005 REFLOW]
C68  470nF  [CAPACITOR 1005 REFLOW]
C69  470nF  [CAPACITOR 1005 REFLOW]
C70  470nF  [CAPACITOR 1005 REFLOW]
C71  100uF  [CAPACITOR 3216 REFLOW]
C72  4.7uF  [CAPACITOR 1608 REFLOW]
C73  470nF  [CAPACITOR 1005 REFLOW]
C74  470nF  [CAPACITOR 1005 REFLOW]
C75  470nF  [CAPACITOR 1005 REFLOW]
C76  470nF  [CAPACITOR 1005 REFLOW]
LD3  *  [LED 1608 REFLOW]
R30  10k  [RESISTOR 1608 REFLOW]
R31  10k  [RESISTOR 1608 REFLOW]
R32  10k  [RESISTOR 1608 REFLOW]
R33  100  [RESISTOR 1608 REFLOW]
R34  4.7k  [RESISTOR 2012 REFLOW]
R35  330  [RESISTOR 2012 REFLOW]
R36  4.7k  [RESISTOR 2012 REFLOW]
R37  100  [RESISTOR 2012 REFLOW]
R38  100  [RESISTOR 1608 REFLOW]
S1  *  [Push Button C2.5X3.0 OMRON B3U-1000P(M)-B]  (value not drawn)
S2  *  [Push Button C2.5X3.0 OMRON B3U-1000P(M)-B]  (value not drawn)
U2  XC6SLX75-FG484  [BGA484 P1.0 C23X23 H2.2]  (parts E,F,G,H of 8)
U3  IS25LP064D-JB  [SO8 P1.27 C4.0X5.0 H1.75]
X2  831022731  [Oscillator C5.2x7.2 IQD LFSPXO]

### Ports
CLK_100MHz (out), FLASH_SPI_CLK (in), FLASH_SPI_CS_N (in), FLASH_SPI_DI (out), FLASH_SPI_DO (in), FPGA_JTAG_TCK (in), FPGA_JTAG_TDI (in), FPGA_JTAG_TDO (out), FPGA_JTAG_TMS (in), SOFTRESET_N (out)

### Nets
+1.2V_CORE: C47.1 C48.1 C49.1 C50.1 C51.1 C52.1 C53.1 C54.1 C55.1 C56.1 C57.1 U2.J8(VCCINT) U2.J10(VCCINT) U2.J12(VCCINT) U2.J14(VCCINT) U2.K9(VCCINT) U2.K11(VCCINT) U2.K13(VCCINT) U2.L10(VCCINT) U2.L12(VCCINT) U2.L14(VCCINT) U2.M9(VCCINT) U2.M11(VCCINT) U2.M13(VCCINT) U2.N10(VCCINT) U2.N12(VCCINT) U2.N14(VCCINT) U2.P9(VCCINT) U2.P11(VCCINT) U2.P13(VCCINT) U2.R14(VCCINT)
+3V3_D: C35.1 C36.1 C37.1 C38.1 C39.1 C40.1 C41.1 C42.1 C43.1 C44.1 C45.1 C46.1 C58.1 C59.1 C60.1 C61.1 C62.1 C63.1 C64.1 C65.1 C66.1 C67.1 C68.1 C69.1 C70.1 C71.1 C72.1 C73.1 C74.1 C75.1 C76.1 R30.2 R31.2 R32.2 R33.2 R34.2 R35.2 R36.2 U2.AA3(VCCO_2) U2.AA7(VCCO_2) U2.AA11(VCCO_2) U2.AA15(VCCO_2) U2.AA19(VCCO_2) U2.B4(VCCO_0) U2.B7(VCCO_0) U2.B11(VCCO_0) U2.B15(VCCO_0) U2.B19(VCCO_0) U2.C2(VCCO_3) U2.C21(VCCO_1) U2.D16(VCCAUX) U2.E9(VCCO_0) U2.E13(VCCO_0) U2.E17(VCCO_0) U2.E19(VCCO_1) U2.F4(VCCO_3) U2.F6(VCCO_3) U2.F11(VCCAUX) U2.G2(VCCO_3) U2.G10(VCCO_0) U2.G12(VCCAUX) U2.G14(VCCO_0) U2.G21(VCCO_1) U2.H9(VCCAUX) U2.H15(VCCAUX) U2.J5(VCCO_3) U2.J18(VCCO_1) U2.K15(VCCAUX) U2.L2(VCCO_3) U2.L7(VCCO_3) U2.L8(VCCAUX) U2.L16(VCCO_1) U2.L21(VCCO_1) U2.M15(VCCAUX) U2.N5(VCCO_3) U2.N8(VCCAUX) U2.N18(VCCO_1) U2.R2(VCCO_3) U2.R6(VCCAUX) U2.R10(VCCAUX) U2.R12(VCCAUX) U2.R21(VCCO_1) U2.T9(VCCO_2) U2.T13(VCCO_2) U2.U5(VCCO_3) U2.U11(VCCAUX) U2.U18(VCCO_1) U2.V6(VCCAUX) U2.V8(VCCO_2) U2.V12(VCCO_2) U2.V16(VCCO_2) U2.W2(VCCO_3) U2.W5(VCCO_2) U2.W21(VCCO_1) U3.8(VCC) X2.1(STB) X2.4(+VS)
GND_D: C33.1 C34.1 C35.2 C36.2 C37.2 C38.2 C39.2 C40.2 C41.2 C42.2 C43.2 C44.2 C45.2 C46.2 C47.2 C48.2 C49.2 C50.2 C51.2 C52.2 C53.2 C54.2 C55.2 C56.2 C57.2 C58.2 C59.2 C60.2 C61.2 C62.2 C63.2 C64.2 C65.2 C66.2 C67.2 C68.2 C69.2 C70.2 C71.2 C72.2 C73.2 C74.2 C75.2 C76.2 R37.1 R38.1 S1.1 S2.1 U2.A1(GND) U2.A22(GND) U2.AA5(GND) U2.AA9(GND) U2.AA13(GND) U2.AA17(GND) U2.AB1(GND) U2.AB22(GND) U2.B5(GND) U2.B9(GND) U2.B13(GND) U2.B17(GND) U2.D4(GND) U2.D18(GND) U2.E2(GND) U2.E7(GND) U2.E11(GND) U2.E15(GND) U2.E21(GND) U2.G5(GND) U2.G18(GND) U2.H7(GND) U2.J2(GND) U2.J9(GND) U2.J11(GND) U2.J13(GND) U2.J15(GND) U2.J21(GND) U2.K10(GND) U2.K12(GND) U2.K14(GND) U2.L5(GND) U2.L9(GND) U2.L11(GND) U2.L13(GND) U2.L18(GND) U2.M10(GND) U2.M12(GND) U2.M14(GND) U2.N2(GND) U2.N9(GND) U2.N11(GND) U2.N13(GND) U2.N15(SUSPEND) U2.N17(GND) U2.N21(GND) U2.P10(GND) U2.P12(GND) U2.P14(GND) U2.P15(RFUSE) U2.P16(VFS) U2.R5(GND) U2.R17(VBATT) U2.R18(GND) U2.U2(GND) U2.U7(GND) U2.U21(GND) U2.V4(GND) U2.V10(GND) U2.V14(GND) U2.W7(GND) U2.W16(GND) U2.W19(GND) U3.4(GND) X2.2(GND)
CLK_100MHz: X2.3(OUT) ; port CLK_100MHz
FLASH_SPI_CLK: R33.1 R38.2 U3.6(SCK) ; port FLASH_SPI_CLK
FLASH_SPI_CS_N: R31.1 U3.1(~{CE}) ; port FLASH_SPI_CS_N
FLASH_SPI_DI: U3.2(SO) ; port FLASH_SPI_DI
FLASH_SPI_DO: U3.5(SI) ; port FLASH_SPI_DO
FPGA_DONE: LD3.2(A) R35.1 U2.Y22(DONE_2)
FPGA_JTAG_TCK: U2.G15(TCK) ; port FPGA_JTAG_TCK
FPGA_JTAG_TDI: U2.E18(TDI) ; port FPGA_JTAG_TDI
FPGA_JTAG_TDO: U2.A19(TDO) ; port FPGA_JTAG_TDO
FPGA_JTAG_TMS: U2.C18(TMS) ; port FPGA_JTAG_TMS
HARDRESET_N: C33.2 R34.1 S1.2 U2.AA1(PROGRAM_B_2)
SOFTRESET_N: C34.2 R36.1 S2.2 ; port SOFTRESET_N
NetLD3_1: LD3.1(C) R37.2
NetR30_1: R30.1 U3.3(~{WP})
NetR32_1: R32.1 U3.7(~{H}/~{R})

Not connected (* = marked no-connect by the designer): U2 AB5(NC)* E8(NC)* E10(NC)* F8(NC)* F9(NC)* F10(NC)* F12(NC)* G8(NC)* G9(NC)* G11(NC)* H10(NC)* H11(NC)* H12(NC)* R7(NC)* R8(NC)* R9(NC)* R11(NC)* R13(NC)* R15(NC)* R16(NC)* T7(NC)* T8(NC)* T10(NC)* T11(NC)* T12(NC)* T14(NC)* T15(NC)* T16(NC)* U6(NC)* U8(NC)* U9(NC)* U10(NC)* U12(NC)* U16(NC)* U17(NC)* V5(NC)* V7(NC)* V9(NC)* V13(NC)* V17(NC)* V18(NC)* V19(NC)* W6(NC)* W8(NC)* W9(NC)* W10(NC)* W13(NC)* W14(NC)* W15(NC)* W17(NC)* W18(NC)* Y5(NC)* Y6(NC)* Y8(NC)* Y10(NC)* Y14(NC)* Y16(NC)* Y18(NC)* Y20(CMPCS_B_2)*

### Notes on the sheet
- FPGA FLASH
- FPGA DONE LED
- RESET BUTTONS
- FPGA OSCILLATOR
- FPGA SUPPLY PINS
- FPGA CONFIGURATION PINS
- FPGA DECOUPLING
- VCC0 Bank 0 Decoupling
  LX75, LX100, LX150 -> 1x100uF / 1x4.7uF / 2x470nF
- (near U2) FPGA UNUSED PINS
- VCC0 Bank 1 Decoupling
  LX75, LX100, LX150 -> 1x100uF / 1x4.7uF / 3x470nF
- VCCINT Decoupling
  LX75 -> 1x100uF / 2x4.7uF / 3x470nF
  LX100 -> 1x100uF / 2x4.7uF / 4x470nF
  LX150 -> 2x100uF / 3x4.7uF / 6x470nF
- VCC0 Bank 2 Decoupling
  LX100, LX150 -> 1x100uF / 1x4.7uF / 3x470nF
  LX75 -> 1x100uF / 1x4.7uF / 4x470nF
- VCCAUX Decoupling
  LX75, LX100, LX150 -> 1x100uF / 2x4.7uF / 4x470nF
- VCC0 Bank 3 Decoupling
  LX75. LX100, LX150 -> 1x100uF / 1x4.7uF / 3x470nF
- Date :
- Revision :
- Sheet
- of
- Design by :

### Library data of the parts
C33-C76 = Capacitor
  C33 C34: Value: 100nF
  C35 C41 C47 C48 C58 C64 C71: Value: 100uF
  C36 C42 C49-C51 C59 C65 C66 C72: Value: 4.7uF
  C37-C40 C43-C46 C52-C57 C60-C63 C67-C70 C73-C76: Value: 470nF
LD3 = LED: LED generic; Value: *
R30-R33 R38 = Resistor: Resistor 1% 50V 100mW 1608(0603)
  R30-R32: Value: 10k
  R33 R38: Value: 100
R34-R37 = Resistor: Resistor 1% 50V 125mW 2012(0805)
  R34 R36: Value: 4.7k
  R35: Value: 330
  R37: Value: 100
S1 S2 = Push Button 2Pins: Push Button, 2 pins; Value: *
U2 = XC6SLX75-FG484: as U2 on sheet FPGA_0; Value: XC6SLX75-FG484
U3 = IS25LP064D-JB: 64Mb Serial Flash Memory; Value: IS25LP064D-JB
X2 = Oscillator C5.2x7.2 IQD LFSPXO: Value: 831022731; MouserNumber: 710-831022731

## Sheet Ethernet_0.SchDoc
size A2; Date: Date; CompanyName: HESSO; Engineer: Name; Address1: Route du Rawyl 47; Address2: 1950 Sion; Address3: Switzerland; ProjectName: Project Name
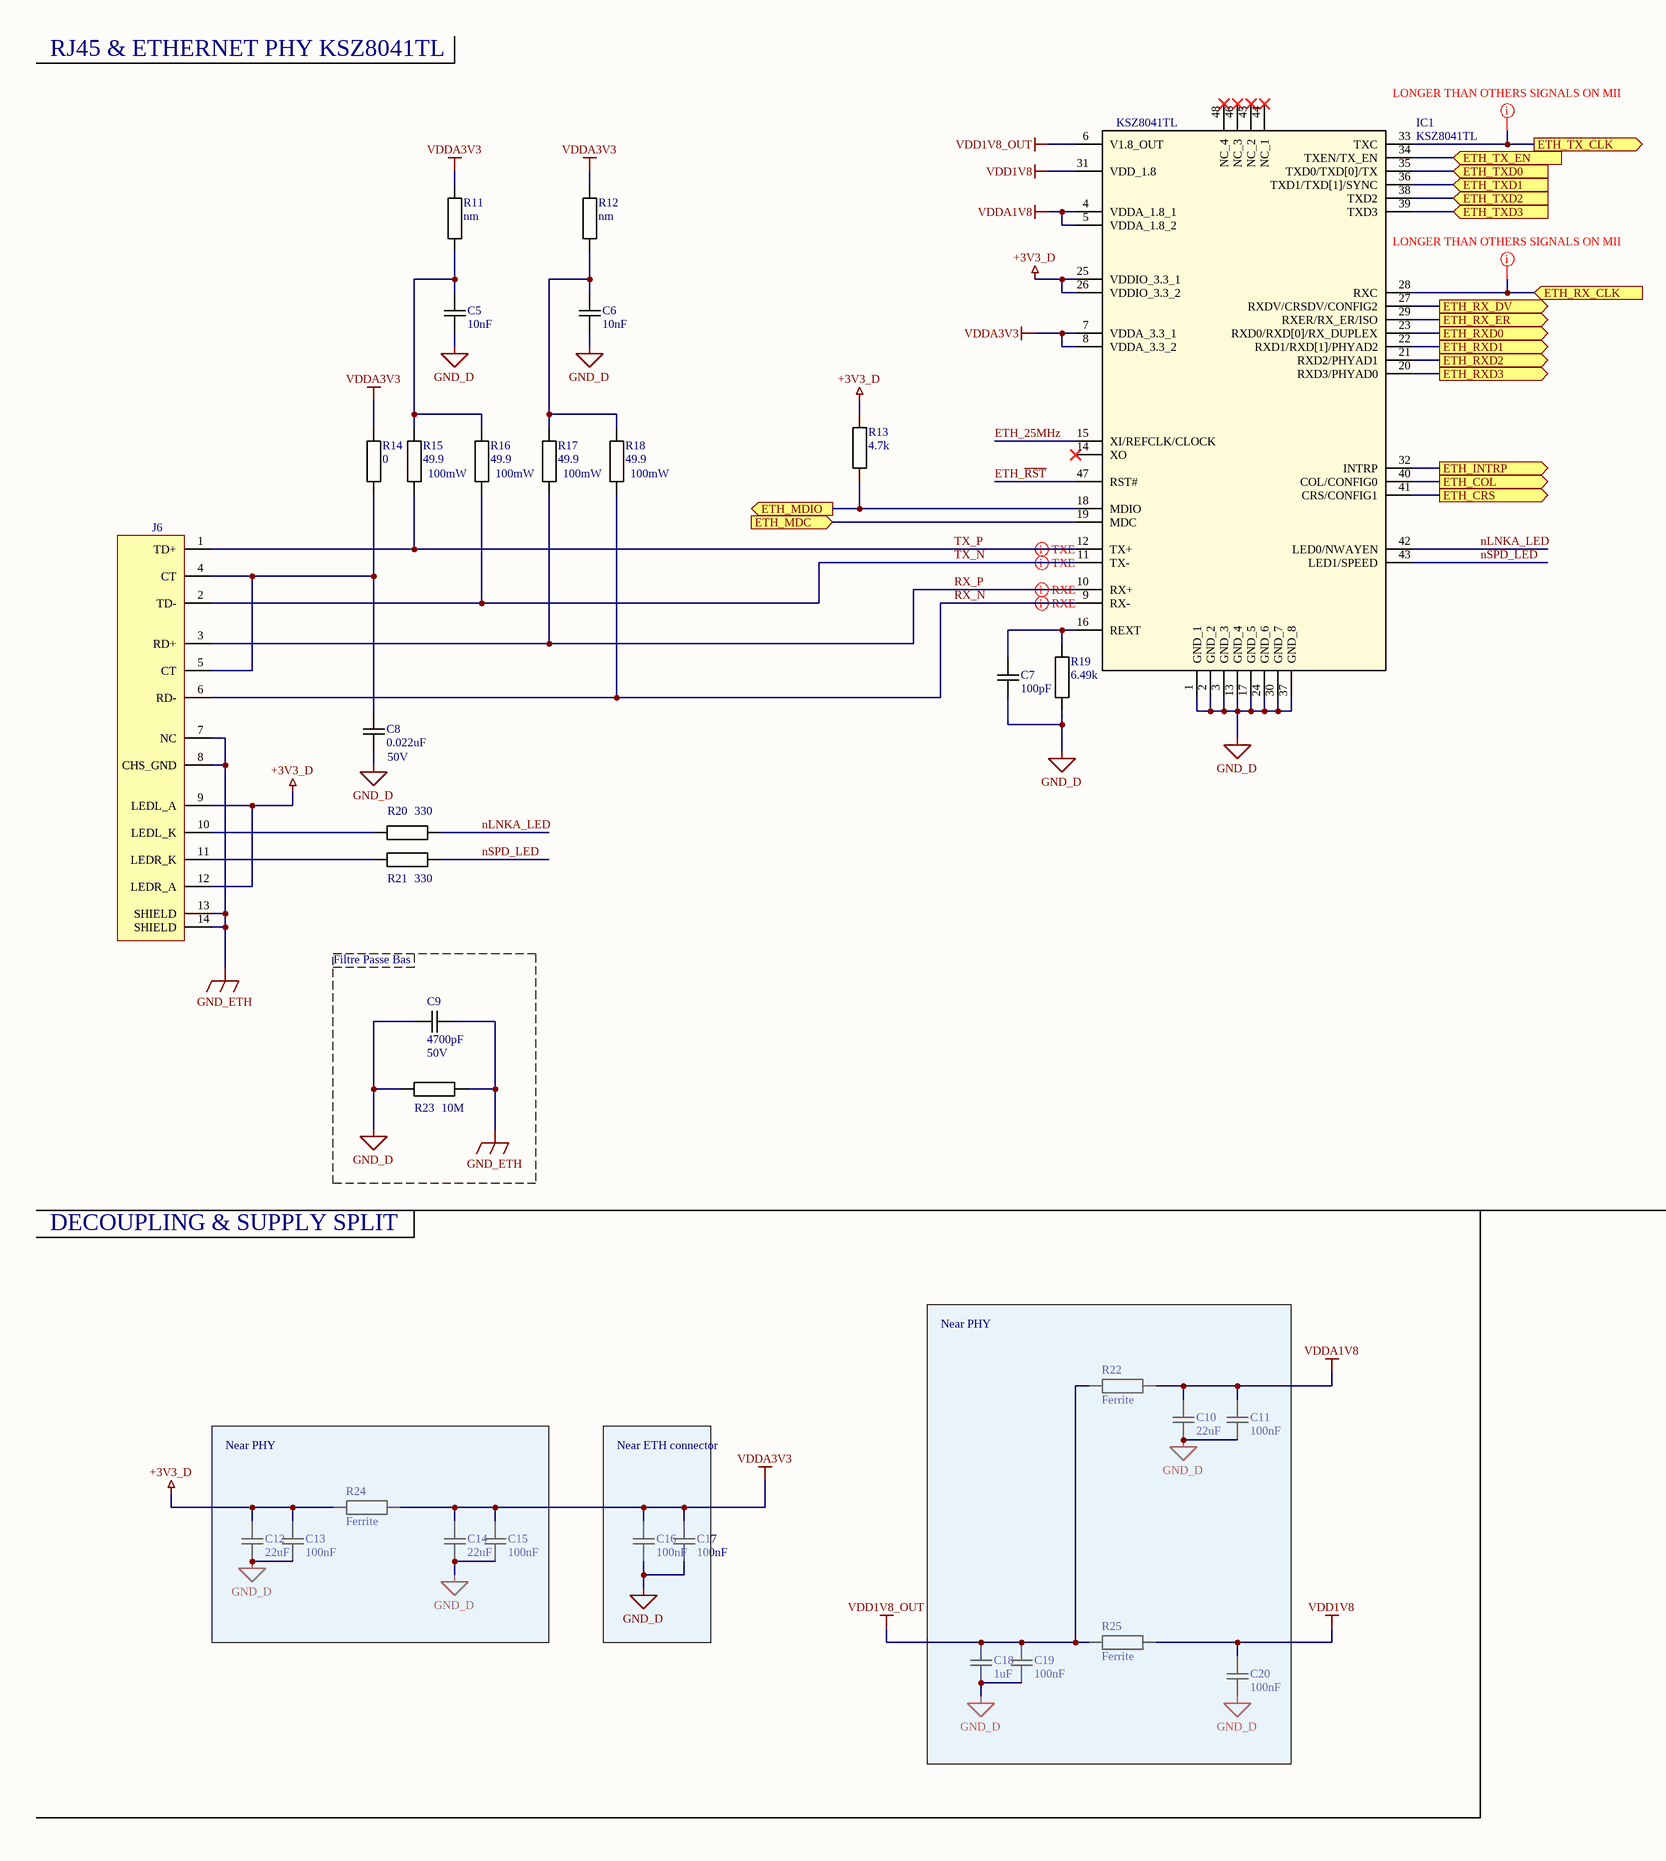
[diagram p4: Ethernet_0.SchDoc, left]
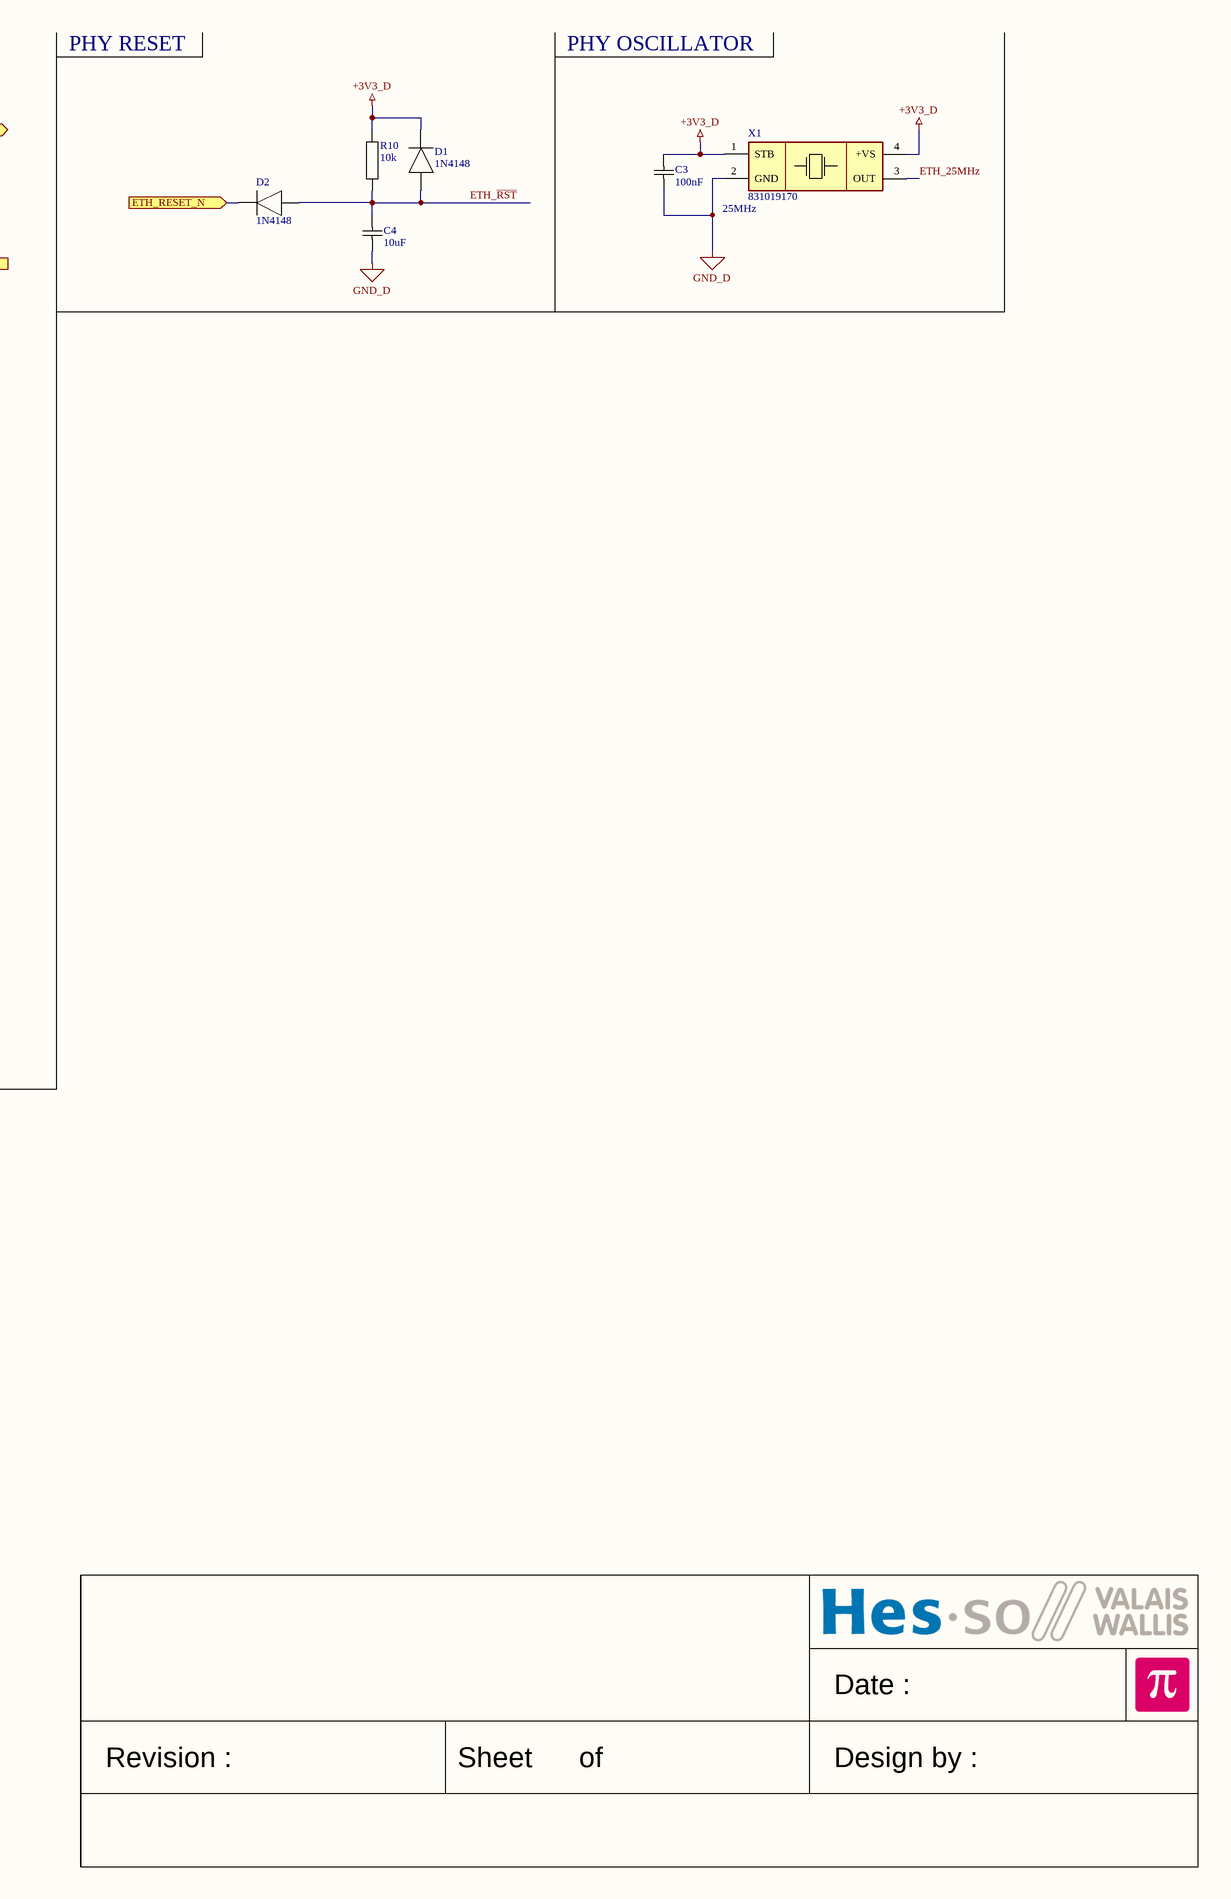
[diagram p5: Ethernet_0.SchDoc, right]

### Parts
C3  100nF  [CAPACITOR 1608 REFLOW]
C4  10uF  [CAPACITOR 2012 REFLOW]
C5  10nF  [CAPACITOR 1608 REFLOW]
C6  10nF  [CAPACITOR 1608 REFLOW]
C7  100pF  [CAPACITOR 1608 REFLOW]
C8  0.022uF  V: 50V  [CAPACITOR 1608 REFLOW]
C9  4700pF  U: 50V  [CAPACITOR 1608 REFLOW]
C10  22uF  [CAPACITOR 2012 REFLOW]
C11  100nF  [CAPACITOR 1608 REFLOW]
C12  22uF  [CAPACITOR 2012 REFLOW]
C13  100nF  [CAPACITOR 1608 REFLOW]
C14  22uF  [CAPACITOR 2012 REFLOW]
C15  100nF  [CAPACITOR 1608 REFLOW]
C16  100nF  [CAPACITOR 1608 REFLOW]
C17  100nF  [CAPACITOR 1608 REFLOW]
C18  1uF  [CAPACITOR 2012 REFLOW]
C19  100nF  [CAPACITOR 1608 REFLOW]
C20  100nF  [CAPACITOR 1608 REFLOW]
D1  1N4148  [DIODE SOD323 REFLOW]
D2  1N4148  [DIODE SOD323 REFLOW]
IC1  KSZ8041TL  [QFP50P900X900X105-48N]
J6  RJ45-PULSE-J0011D21BNL  [RJ45 PULSE J0011D21BNL]  (value not drawn)
R10  10k  [RESISTOR 1608 REFLOW]
R11  nm  [RESISTOR 1608 REFLOW]
R12  nm  [RESISTOR 1608 REFLOW]
R13  4.7k  [RESISTOR 1608 REFLOW]
R14  0  [RESISTOR 1608 REFLOW]
R15  49.9  W: 100mW  [RESISTOR 1608 REFLOW]
R16  49.9  W: 100mW  [RESISTOR 1608 REFLOW]
R17  49.9  W: 100mW  [RESISTOR 1608 REFLOW]
R18  49.9  W: 100mW  [RESISTOR 1608 REFLOW]
R19  6.49k  [RESISTOR 1608 REFLOW]
R20  330  [RESISTOR 1608 REFLOW]
R21  330  [RESISTOR 1608 REFLOW]
R22  Ferrite  [RESISTOR 1608 REFLOW]
R23  10M  [RESISTOR 1608 REFLOW]
R24  Ferrite  [RESISTOR 1608 REFLOW]
R25  Ferrite  [RESISTOR 1608 REFLOW]
X1  831019170  Freq: 25MHz  [Oscillator C5.2x7.2 IQD LFSPXO]

### Blocks framed on the sheet
Filtre Passe Bas: C9 R23
Near PHY: C10 C11 C18-C20 R22 R25
Near PHY: C12-C15 R24
Near ETH connector: C16 C17

### Ports
ETH_COL (out), ETH_CRS (out), ETH_INTRP (out), ETH_MDC (in), ETH_MDIO (out), ETH_RESET_N (in), ETH_RX_CLK (in), ETH_RX_DV (out), ETH_RX_ER (out), ETH_RXD0 (out), ETH_RXD1 (out), ETH_RXD2 (out), ETH_RXD3 (out), ETH_TX_CLK (out), ETH_TX_EN (in), ETH_TXD0 (in), ETH_TXD1 (in), ETH_TXD2 (in), ETH_TXD3 (in)

### Nets
+3V3_D: C3.2 C12.2 C13.2 D1.1(C) IC1.25(VDDIO_3.3_1) IC1.26(VDDIO_3.3_2) J6.9(LEDL_A) J6.12(LEDR_A) R10.2 R13.2 R24.2 X1.1(STB) X1.4(+VS)
GND_D: C3.1 C4.1 C5.1 C6.1 C7.1 C8.2 C9.1 C10.1 C11.1 C12.1 C13.1 C14.1 C15.1 C16.1 C17.1 C18.1 C19.1 C20.1 IC1.1(GND_1) IC1.2(GND_2) IC1.3(GND_3) IC1.13(GND_4) IC1.17(GND_5) IC1.24(GND_6) IC1.30(GND_7) IC1.37(GND_8) R19.1 R23.2 X1.2(GND)
GND_ETH: C9.2 J6.7(NC) J6.8(CHS_GND) J6.13(SHIELD) J6.14(SHIELD) R23.1
VDD1V8: C20.2 IC1.31(VDD_1.8) R25.1
VDD1V8_OUT: C18.2 C19.2 IC1.6(V1.8_OUT) R22.2 R25.2
VDDA1V8: C10.2 C11.2 IC1.4(VDDA_1.8_1) IC1.5(VDDA_1.8_2) R22.1
VDDA3V3: C14.2 C15.2 C16.2 C17.2 IC1.7(VDDA_3.3_1) IC1.8(VDDA_3.3_2) R11.2 R12.2 R14.2 R24.1
ETH_25MHz: IC1.15(XI/REFCLK/CLOCK) X1.3(OUT)
ETH_COL: IC1.40(COL/CONFIG0) ; port ETH_COL
ETH_CRS: IC1.41(CRS/CONFIG1) ; port ETH_CRS
ETH_INTRP: IC1.32(INTRP) ; port ETH_INTRP
ETH_MDC: IC1.19(MDC) ; port ETH_MDC
ETH_MDIO: IC1.18(MDIO) R13.1 ; port ETH_MDIO
ETH_~{RST}: C4.2 D1.2(A) D2.2(A) IC1.47(RST#) R10.1
ETH_RESET_N: D2.1(C) ; port ETH_RESET_N
ETH_RX_CLK: IC1.28(RXC) ; port ETH_RX_CLK
ETH_RX_DV: IC1.27(RXDV/CRSDV/CONFIG2) ; port ETH_RX_DV
ETH_RX_ER: IC1.29(RXER/RX_ER/ISO) ; port ETH_RX_ER
ETH_RXD0: IC1.23(RXD0/RXD[0]/RX_DUPLEX) ; port ETH_RXD0
ETH_RXD1: IC1.22(RXD1/RXD[1]/PHYAD2) ; port ETH_RXD1
ETH_RXD2: IC1.21(RXD2/PHYAD1) ; port ETH_RXD2
ETH_RXD3: IC1.20(RXD3/PHYAD0) ; port ETH_RXD3
ETH_TX_CLK: IC1.33(TXC) ; port ETH_TX_CLK
ETH_TX_EN: IC1.34(TXEN/TX_EN) ; port ETH_TX_EN
ETH_TXD0: IC1.35(TXD0/TXD[0]/TX) ; port ETH_TXD0
ETH_TXD1: IC1.36(TXD1/TXD[1]/SYNC) ; port ETH_TXD1
ETH_TXD2: IC1.38(TXD2) ; port ETH_TXD2
ETH_TXD3: IC1.39(TXD3) ; port ETH_TXD3
nLNKA_LED: IC1.42(LED0/NWAYEN) R20.1
nSPD_LED: IC1.43(LED1/SPEED) R21.1
RX_N: IC1.9(RX-) J6.6(RD-) R18.1
RX_P: IC1.10(RX+) J6.3(RD+) R17.1
TX_N: IC1.11(TX-) J6.2(TD-) R16.1
TX_P: IC1.12(TX+) J6.1(TD+) R15.1
NetC5_2: C5.2 R11.1 R15.2 R16.2
NetC6_2: C6.2 R12.1 R17.2 R18.2
NetC7_2: C7.2 IC1.16(REXT) R19.2
NetC8_1: C8.1 J6.4(CT) J6.5(CT) R14.1
NetJ6_10: J6.10(LEDL_K) R20.2
NetJ6_11: J6.11(LEDR_K) R21.2

Not connected (* = marked no-connect by the designer): IC1 14(XO)* 44(NC_1)* 45(NC_2)* 46(NC_3)* 48(NC_4)*

### Layout directives
mark named LONGER THAN OTHERS SIGNALS ON MII: ETH_RX_CLK, ETH_TX_CLK
differential pair: RX_N, RX_P, TX_N, TX_P

### Notes on the sheet
- RJ45 & ETHERNET PHY KSZ8041TL
- PHY RESET
- PHY OSCILLATOR
- DECOUPLING & SUPPLY SPLIT
- Date :
- Revision :
- Sheet
- of
- Design by :

### Library data of the parts
C3-C7 C10-C20 = Capacitor: Capacitor X7R 10% 50V 1608(0603)
  C3 C11 C13 C15-C17 C19 C20: Value: 100nF
  C4: Value: 10uF
  C5 C6: Value: 10nF
  C7: Value: 100pF
  C10 C12 C14: Value: 22uF
  C18: Value: 1uF
C8 C9 = Capacitor: Socket: 1005
  C8: Value: 0.022uF
  C9: Value: 4700pF
D1 D2 = DIODE: Diode generic 2 leads; Value: 1N4148
IC1 = KSZ8041TL: Integrated Circuit; Manufacturer_Name: Microchip; Datasheet Link: http://www.microchip.com/mymicrochip/filehandler.aspx?ddocname=en581559; Height: 1.05mm; Manufacturer_Part_Number: KSZ8041TL; Mouser Part Number: 998-KSZ8041TL; Mouser Price/Stock: https://www.mouser.co.uk/ProductDetail/Microchip-Technology-Micrel/KSZ8041TL?qs=kh6iOki%2FeLG3fBvp35yNQw%3D%3D; Arrow Part Number: KSZ8041TL; Arrow Price/Stock: https://www.arrow.com/en/products/ksz8041tl/microchip-technology
J6 = RJ45 PULSE J0011D21BNL: Integrated connector modules 10/100 base-TX belMag with LEDs; Value: RJ45-PULSE-J0011D21BNL; Supplier 1: Mouser; Supplier Part Number 1: 673-J0011D21BNL
R10 R13 R19 R22 R24 R25 = Resistor: Resistor 1% 50V 100mW 1608(0603)
  R10: Value: 10k
  R13: Value: 4.7k
  R19: Value: 6.49k
  R22 R24 R25: Value: Ferrite
R11 R12 R14-R18 R23 = Resistor
  R11 R12: Value: nm
  R14: Socket: 1005; Value: 0
  R15-R18: Value: 49.9; Socket: 1608
  R23: Value: 10M; Socket: 1005
R20 R21 = Resistor: W: 100mW; Value: 330
X1 = Oscillator C5.2x7.2 IQD LFSPXO: Value: 831019170

## Nets that join several sheets
+3V3_D: FPGA_0 (R26.2 R29.2 R57.2), FPGA_1 (97 pins), Ethernet_0 (13 pins)
GND_D: FPGA_0 (R27.1 R28.1 R56.1), FPGA_1 (113 pins), Ethernet_0 (29 pins)
CLK_100MHz: FPGA_0 (U2.J3), FPGA_1 (X2.3)
ETH_COL: FPGA_0 (U2.P3), Ethernet_0 (IC1.40)
ETH_CRS: FPGA_0 (U2.N4), Ethernet_0 (IC1.41)
ETH_INTRP: FPGA_0 (U2.L6), Ethernet_0 (IC1.32)
ETH_MDC: FPGA_0 (U2.M4), Ethernet_0 (IC1.19)
ETH_MDIO: FPGA_0 (U2.M5), Ethernet_0 (IC1.18 R13.1)
ETH_RESET_N: FPGA_0 (U2.V2), Ethernet_0 (D2.1)
ETH_RX_CLK: FPGA_0 (U2.N6), Ethernet_0 (IC1.28)
ETH_RX_DV: FPGA_0 (U2.N7), Ethernet_0 (IC1.27)
ETH_RX_ER: FPGA_0 (U2.M7), Ethernet_0 (IC1.29)
ETH_RXD0: FPGA_0 (U2.M8), Ethernet_0 (IC1.23)
ETH_RXD1: FPGA_0 (U2.R4), Ethernet_0 (IC1.22)
ETH_RXD2: FPGA_0 (U2.P4), Ethernet_0 (IC1.21)
ETH_RXD3: FPGA_0 (U2.M6), Ethernet_0 (IC1.20)
ETH_TX_CLK: FPGA_0 (U2.P6), Ethernet_0 (IC1.33)
ETH_TX_EN: FPGA_0 (U2.P5), Ethernet_0 (IC1.34)
ETH_TXD0: FPGA_0 (U2.T4), Ethernet_0 (IC1.35)
ETH_TXD1: FPGA_0 (U2.T3), Ethernet_0 (IC1.36)
ETH_TXD2: FPGA_0 (U2.U4), Ethernet_0 (IC1.38)
ETH_TXD3: FPGA_0 (U2.V3), Ethernet_0 (IC1.39)
FLASH_SPI_CLK: FPGA_0 (U2.Y21), FPGA_1 (R33.1 R38.2 U3.6)
FLASH_SPI_CS_N: FPGA_0 (U2.T5), FPGA_1 (R31.1 U3.1)
FLASH_SPI_DI: FPGA_0 (U2.AA20), FPGA_1 (U3.2)
FLASH_SPI_DO: FPGA_0 (U2.AB20), FPGA_1 (U3.5)
SOFTRESET_N: FPGA_0 (U2.J7), FPGA_1 (C34.2 R36.1 S2.2)